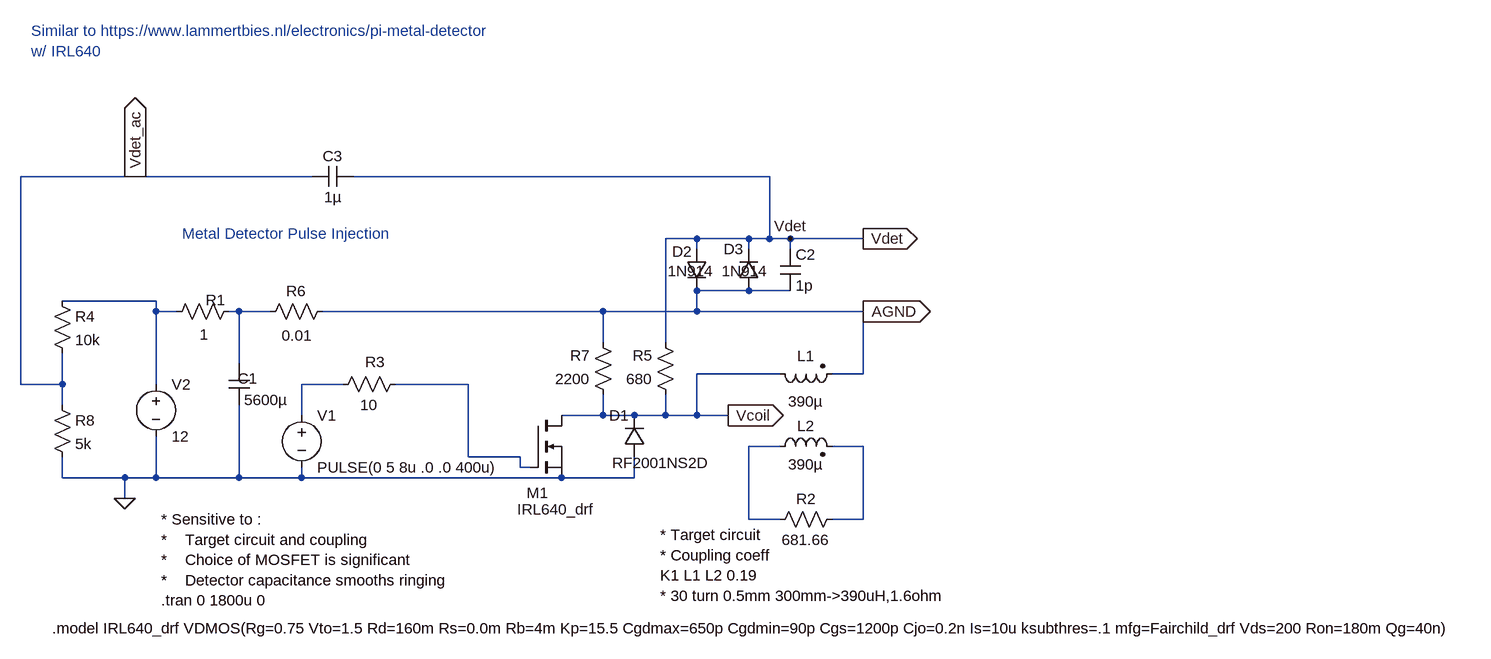
[diagram p0: schematic MetalDetectorPulse.asc]
MetalDetectorPulse.asc, the LTspice schematic file:
Version 4
SHEET 1 1548 680
WIRE -512 -192 -688 -192
WIRE -240 -192 -512 -192
WIRE 464 -192 -176 -192
WIRE 352 -96 304 -96
WIRE 432 -96 352 -96
WIRE 464 -96 464 -192
WIRE 464 -96 432 -96
WIRE 496 -96 464 -96
WIRE 608 -96 496 -96
WIRE 352 -80 352 -96
WIRE 432 -80 432 -96
WIRE 496 -80 496 -96
WIRE 432 -16 352 -16
WIRE 496 -16 432 -16
WIRE -480 0 -624 0
WIRE -480 16 -480 0
WIRE -448 16 -480 16
WIRE -352 16 -368 16
WIRE -304 16 -352 16
WIRE 208 16 -224 16
WIRE 352 16 352 -16
WIRE 352 16 208 16
WIRE 608 16 352 16
WIRE 208 64 208 16
WIRE 304 64 304 -96
WIRE -352 96 -352 16
WIRE 480 112 352 112
WIRE 608 112 608 16
WIRE 608 112 560 112
WIRE -688 128 -688 -192
WIRE -624 128 -624 80
WIRE -624 128 -688 128
WIRE -480 128 -480 16
WIRE -192 128 -256 128
WIRE 0 128 -112 128
WIRE -624 160 -624 128
WIRE -256 176 -256 128
WIRE 208 176 208 144
WIRE 208 176 144 176
WIRE 256 176 208 176
WIRE 304 176 304 144
WIRE 304 176 256 176
WIRE 352 176 352 112
WIRE 352 176 304 176
WIRE 400 176 352 176
WIRE 480 224 432 224
WIRE 608 224 560 224
WIRE 0 240 0 128
WIRE 80 240 0 240
WIRE 80 256 80 240
WIRE 96 256 80 256
WIRE -624 272 -624 240
WIRE -528 272 -624 272
WIRE -480 272 -480 208
WIRE -480 272 -528 272
WIRE -352 272 -352 160
WIRE -352 272 -480 272
WIRE -256 272 -256 256
WIRE -256 272 -352 272
WIRE 144 272 -256 272
WIRE 256 272 256 240
WIRE 256 272 144 272
WIRE -528 304 -528 272
WIRE 432 336 432 224
WIRE 480 336 432 336
WIRE 608 336 608 224
WIRE 608 336 560 336
FLAG 496 -96 Vdet
FLAG -512 -192 Vdet_ac
IOPIN -512 -192 Out
FLAG 608 16 AGND
IOPIN 608 16 Out
FLAG -528 304 0
FLAG 608 -96 Vdet
IOPIN 608 -96 Out
FLAG 400 176 Vcoil
IOPIN 400 176 Out
SYMBOL ind2 464 96 M90
WINDOW 0 4 56 VBottom 2
WINDOW 3 43 56 VTop 2
SYMATTR InstName L1
SYMATTR Value 390µ
SYMATTR Type ind
SYMATTR SpiceLine Rser=1.66
SYMBOL ind2 464 240 R270
WINDOW 0 32 56 VTop 2
WINDOW 3 4 56 VBottom 2
SYMATTR InstName L2
SYMATTR Value 390µ
SYMATTR Type ind
SYMBOL res -352 0 R90
WINDOW 0 14 36 VBottom 2
WINDOW 3 36 54 VTop 2
SYMATTR InstName R1
SYMATTR Value 1
SYMBOL res 576 320 R90
WINDOW 0 0 56 VBottom 2
WINDOW 3 32 56 VTop 2
SYMATTR InstName R2
SYMATTR Value 681.66
SYMBOL voltage -256 160 R0
SYMATTR InstName V1
SYMATTR Value PULSE(0 5 8u .0 .0 400u)
SYMBOL voltage -480 112 R0
SYMATTR InstName V2
SYMATTR Value 12
SYMBOL cap -368 96 R0
WINDOW 0 14 23 Left 2
SYMATTR InstName C1
SYMATTR Value 5600µ
SYMBOL nmos 96 176 R0
WINDOW 0 -6 119 Left 2
WINDOW 3 -20 145 Left 2
SYMATTR InstName M1
SYMATTR Value IRL640_drf
SYMBOL res -96 112 R90
WINDOW 0 -3 47 VBottom 2
WINDOW 3 32 56 VTop 2
SYMATTR InstName R3
SYMATTR Value 10
SYMBOL res 320 160 R180
WINDOW 0 36 76 Left 2
WINDOW 3 36 40 Left 2
SYMATTR InstName R5
SYMATTR Value 680
SYMBOL diode 336 -80 R0
WINDOW 0 -22 4 Left 2
WINDOW 3 -29 34 Left 2
SYMATTR InstName D2
SYMATTR Value 1N914
SYMBOL diode 448 -16 R180
WINDOW 0 24 64 Left 2
WINDOW 3 -14 30 Left 2
SYMATTR InstName D3
SYMATTR Value 1N914
SYMBOL res -208 0 R90
WINDOW 0 0 56 VBottom 2
WINDOW 3 37 55 VTop 2
SYMATTR InstName R6
SYMATTR Value 0.01
SYMBOL cap 480 -80 R0
SYMATTR InstName C2
SYMATTR Value 1p
SYMBOL res 224 160 R180
WINDOW 0 36 76 Left 2
WINDOW 3 36 40 Left 2
SYMATTR InstName R7
SYMATTR Value 2200
SYMBOL res -640 -16 R0
SYMATTR InstName R4
SYMATTR Value 10k
SYMBOL res -640 144 R0
SYMATTR InstName R8
SYMATTR Value 5k
SYMBOL cap -176 -208 R90
WINDOW 0 0 32 VBottom 2
WINDOW 3 32 32 VTop 2
SYMATTR InstName C3
SYMATTR Value 1µ
SYMBOL diode 272 240 R180
WINDOW 0 24 64 Left 2
WINDOW 3 -100 -9 Left 2
SYMATTR InstName D1
SYMATTR Value RF2001NS2D
TEXT 296 360 Left 2 !* Target circuit\n* Coupling coeff\nK1 L1 L2 0.19\n* 30 turn 0.5mm 300mm->390uH,1.6ohm
TEXT -472 336 Left 2 !* Sensitive to :\n*    Target circuit and coupling \n*    Choice of MOSFET is significant\n*    Detector capacitance smooths ringing\n.tran 0 1800u 0
TEXT -440 -104 Left 2 ;Metal Detector Pulse Injection
TEXT -640 504 Left 2 !.model IRL640_drf VDMOS(Rg=0.75 Vto=1.5 Rd=160m Rs=0.0m Rb=4m Kp=15.5 Cgdmax=650p Cgdmin=90p Cgs=1200p Cjo=0.2n Is=10u ksubthres=.1 mfg=Fairchild_drf Vds=200 Ron=180m Qg=40n)
TEXT -672 -416 Left 2 ;Similar to https://www.lammertbies.nl/electronics/pi-metal-detector\nw/ IRL640

The netlist it stands for:
* MetalDetectorPulse.asc
L1 Vcoil AGND 390µ Rser=1.66
L2 N005 N006 390µ
R1 N002 N001 1
R2 N006 N005 681.66
V1 N003 0 PULSE(0 5 8u .0 .0 400u)
V2 N001 0 12
C1 N002 0 5600µ
M1 Vcoil N004 0 0 IRL640_drf
R3 N004 N003 10
R5 Vcoil Vdet 680
D2 Vdet AGND 1N914
D3 AGND Vdet 1N914
R6 AGND N002 0.01
C2 Vdet AGND 1p
R7 Vcoil AGND 2200
R4 N001 Vdet_ac 10k
R8 Vdet_ac 0 5k
C3 Vdet Vdet_ac 1µ
D1 0 Vcoil RF2001NS2D
.model D D
.lib standard.dio
.model NMOS NMOS
.model PMOS PMOS
.lib standard.mos
* Target circuit
* Coupling coeff
K1 L1 L2 0.19
* 30 turn 0.5mm 300mm->390uH,1.6ohm
* Sensitive to :
*    Target circuit and coupling
*    Choice of MOSFET is significant
*    Detector capacitance smooths ringing
.tran 0 1800u 0
* Metal Detector Pulse Injection
.model IRL640_drf VDMOS(Rg=0.75 Vto=1.5 Rd=160m Rs=0.0m Rb=4m Kp=15.5 Cgdmax=650p Cgdmin=90p Cgs=1200p Cjo=0.2n Is=10u ksubthres=.1 mfg=Fairchild_drf Vds=200 Ron=180m Qg=40n)
* Similar to https://www.lammertbies.nl/electronics/pi-metal-detector
* w/ IRL640
.backanno
.end